# EasyEDA schematic SCH_VE-GENERATOR_2026-01-31.json
TITLE: -VE GENERATOR; REV: 1.0; Date: 2026-01-31; Sheet: 1/1; Drawn By: thulasizwephetha23; Company: Your Company
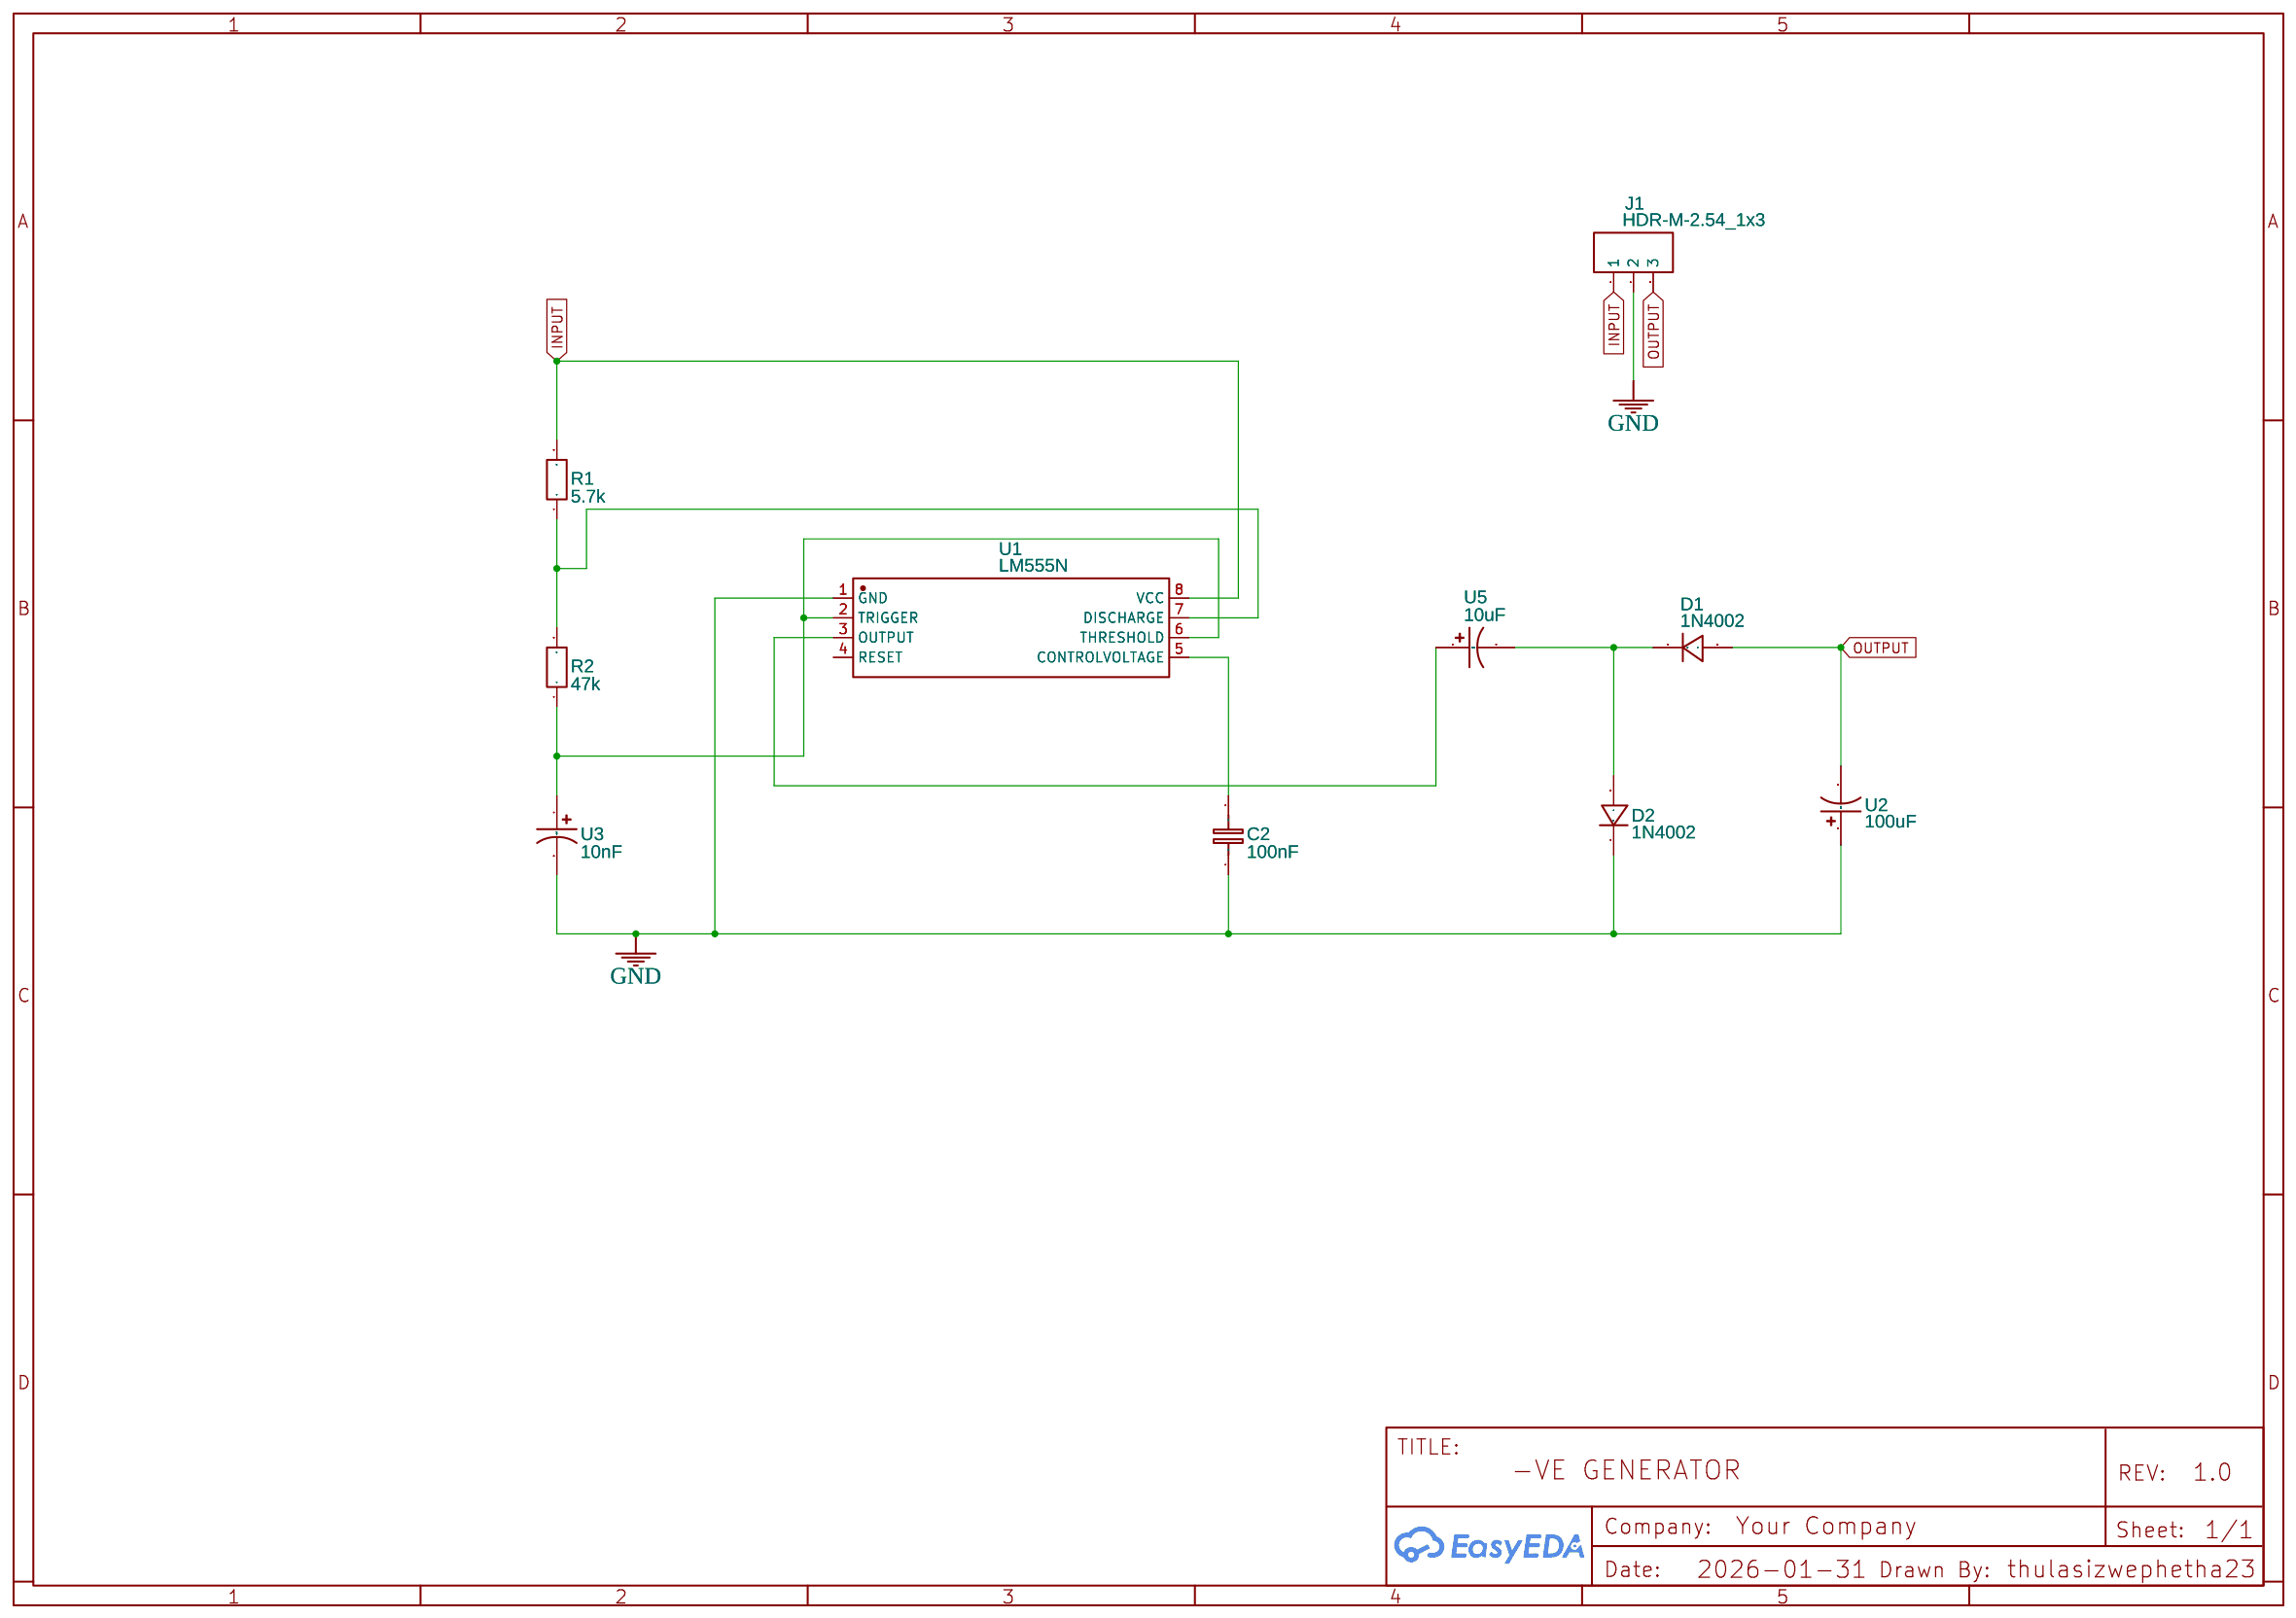
[diagram p0: schematic sheet]

## Parts
C2  100nF  [RAD-0.1]
D1  1N4002  [DO-41_BD2.4-L4.7-P8.70-D0.9-RD]
D2  1N4002  [DO-41_BD2.4-L4.7-P8.70-D0.9-RD]
J1  HDR-M-2.54_1x3  [HDR-M-2.54_1X3]
R1  5.7k  [R_AXIAL-0.3]
R2  47k  [R_AXIAL-0.3]
U1  LM555N  [DIP-8_L9.7-W6.4-P2.54-LS7.6-BL]
U2  100uF  [CAP-TH_BD8.0-P3.50-D0.6-FD]
U3  10nF  [CAP-TH_BD8.0-P3.50-D0.6-FD]
U5  10uF  [CAP-TH_BD8.0-P3.50-D0.6-FD]

## Library data of the parts
C2 = C_RAD-0.1_EU: Contributor: LCEDA_Lib
D1 D2 = 1N4002: Contributor: LCSC; Supplier: LCSC; Supplier Part: C331628; Manufacturer: GW(唯圣); JLCPCB Part Class: Extended Part
J1 = HDR-M-2.54_1x3: Supplier Part: C180248; Supplier: LCSC; Contributor: LCEDA_Lib
R1 R2 = R_AXIAL-0.3_EU: Contributor: LCEDA_Lib
U1 = LM555N: Contributor: LCSC; Supplier: LCSC; Supplier Part: C725327; Manufacturer: HGSEMI(华冠); JLCPCB Part Class: Extended Part
U2 U3 U5 = CAPACITOR_THT:CP_RADIAL_D8.0MM_P2.50MM: Contributor: lcsc; Supplier: LCSC; Supplier Part: C9900016268; Manufacturer: null; Manufacturer Part: Capacitor_THT:CP_Radial_D8.0mm_P2.50mm; JLCPCB Part Class: Extended Part

## Nets
GND: C2.1 D2.1(C) J1.2 U1.1(GND) U2.1 U3.2
INPUT: J1.1 R1.2 U1.8(VCC)
OUTPUT: D1.2(A) J1.3 U2.2
Net-(C2-2): C2.2 U1.5(CONTROLVOLTAGE)
Net-(D1-1): D1.1(C) D2.2(A) U5.2
Net-(R1-1): R1.1 R2.2 U1.7(DISCHARGE)
Net-(R2-1): R2.1 U1.2(TRIGGER) U1.6(THRESHOLD) U3.1
Net-(U1-3): U1.3(OUTPUT) U5.1

Not connected (* = marked no-connect by the designer): U1 4(RESET)
